# Altium project INV.OG5K.PW.V1.PrjPcb
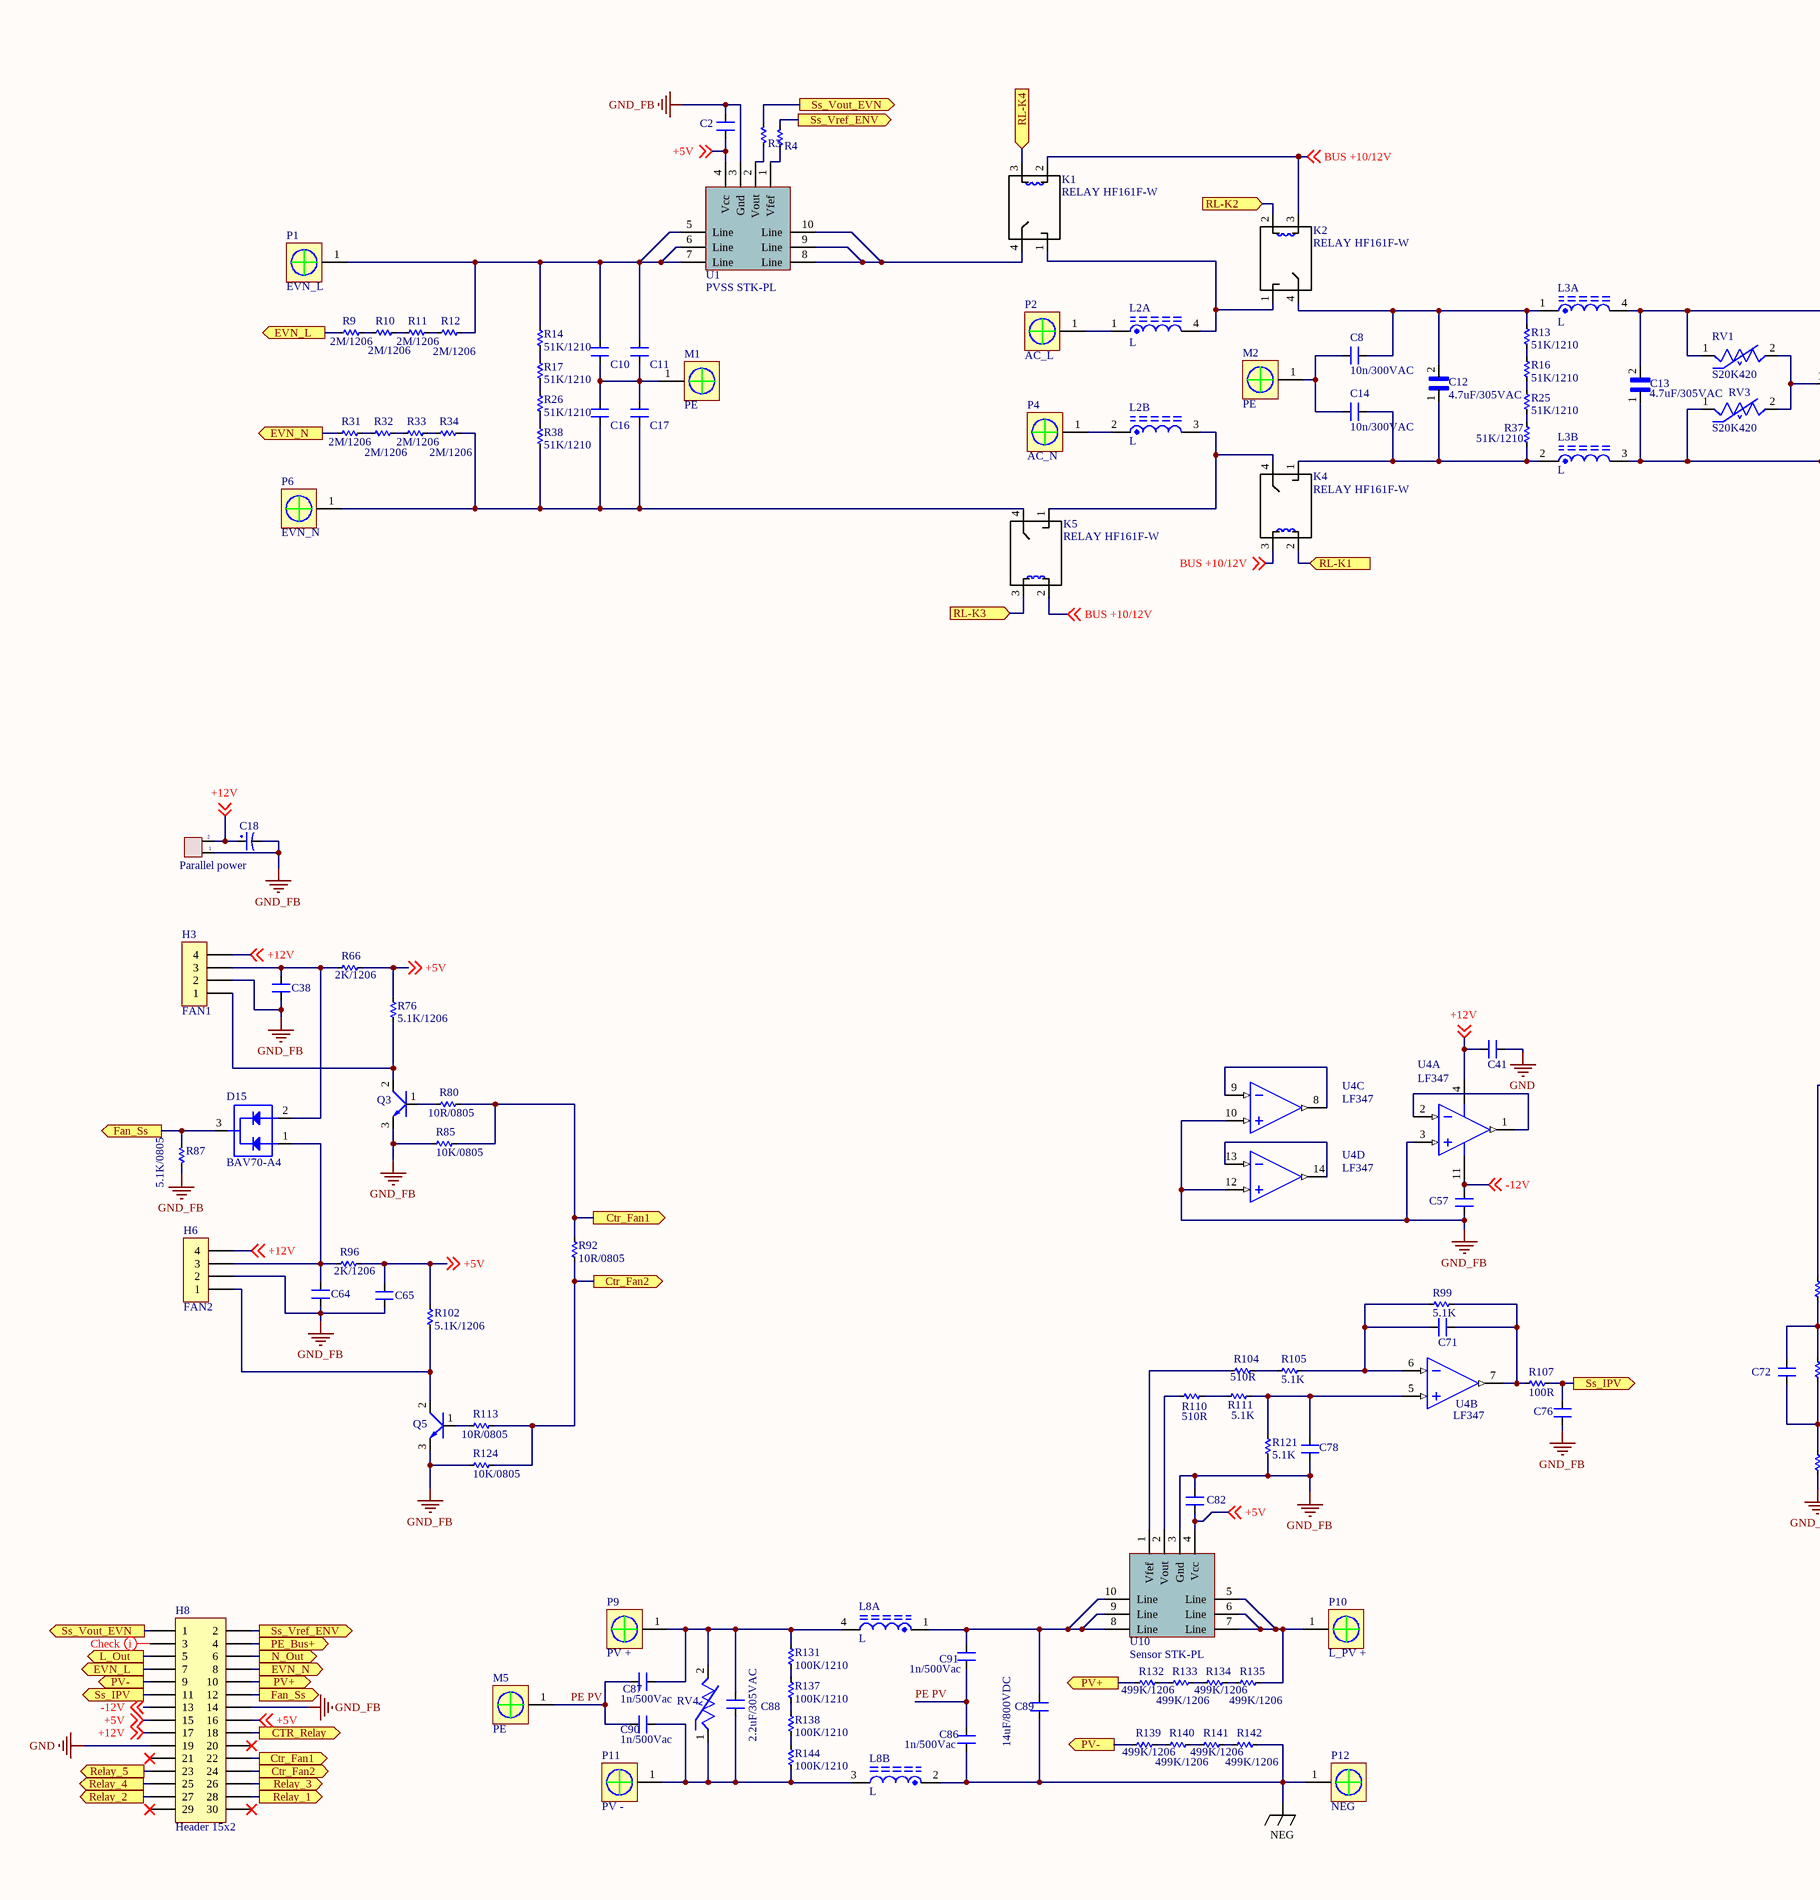
[diagram p0: INV.OG5K.PW.V1.SchDoc, left]
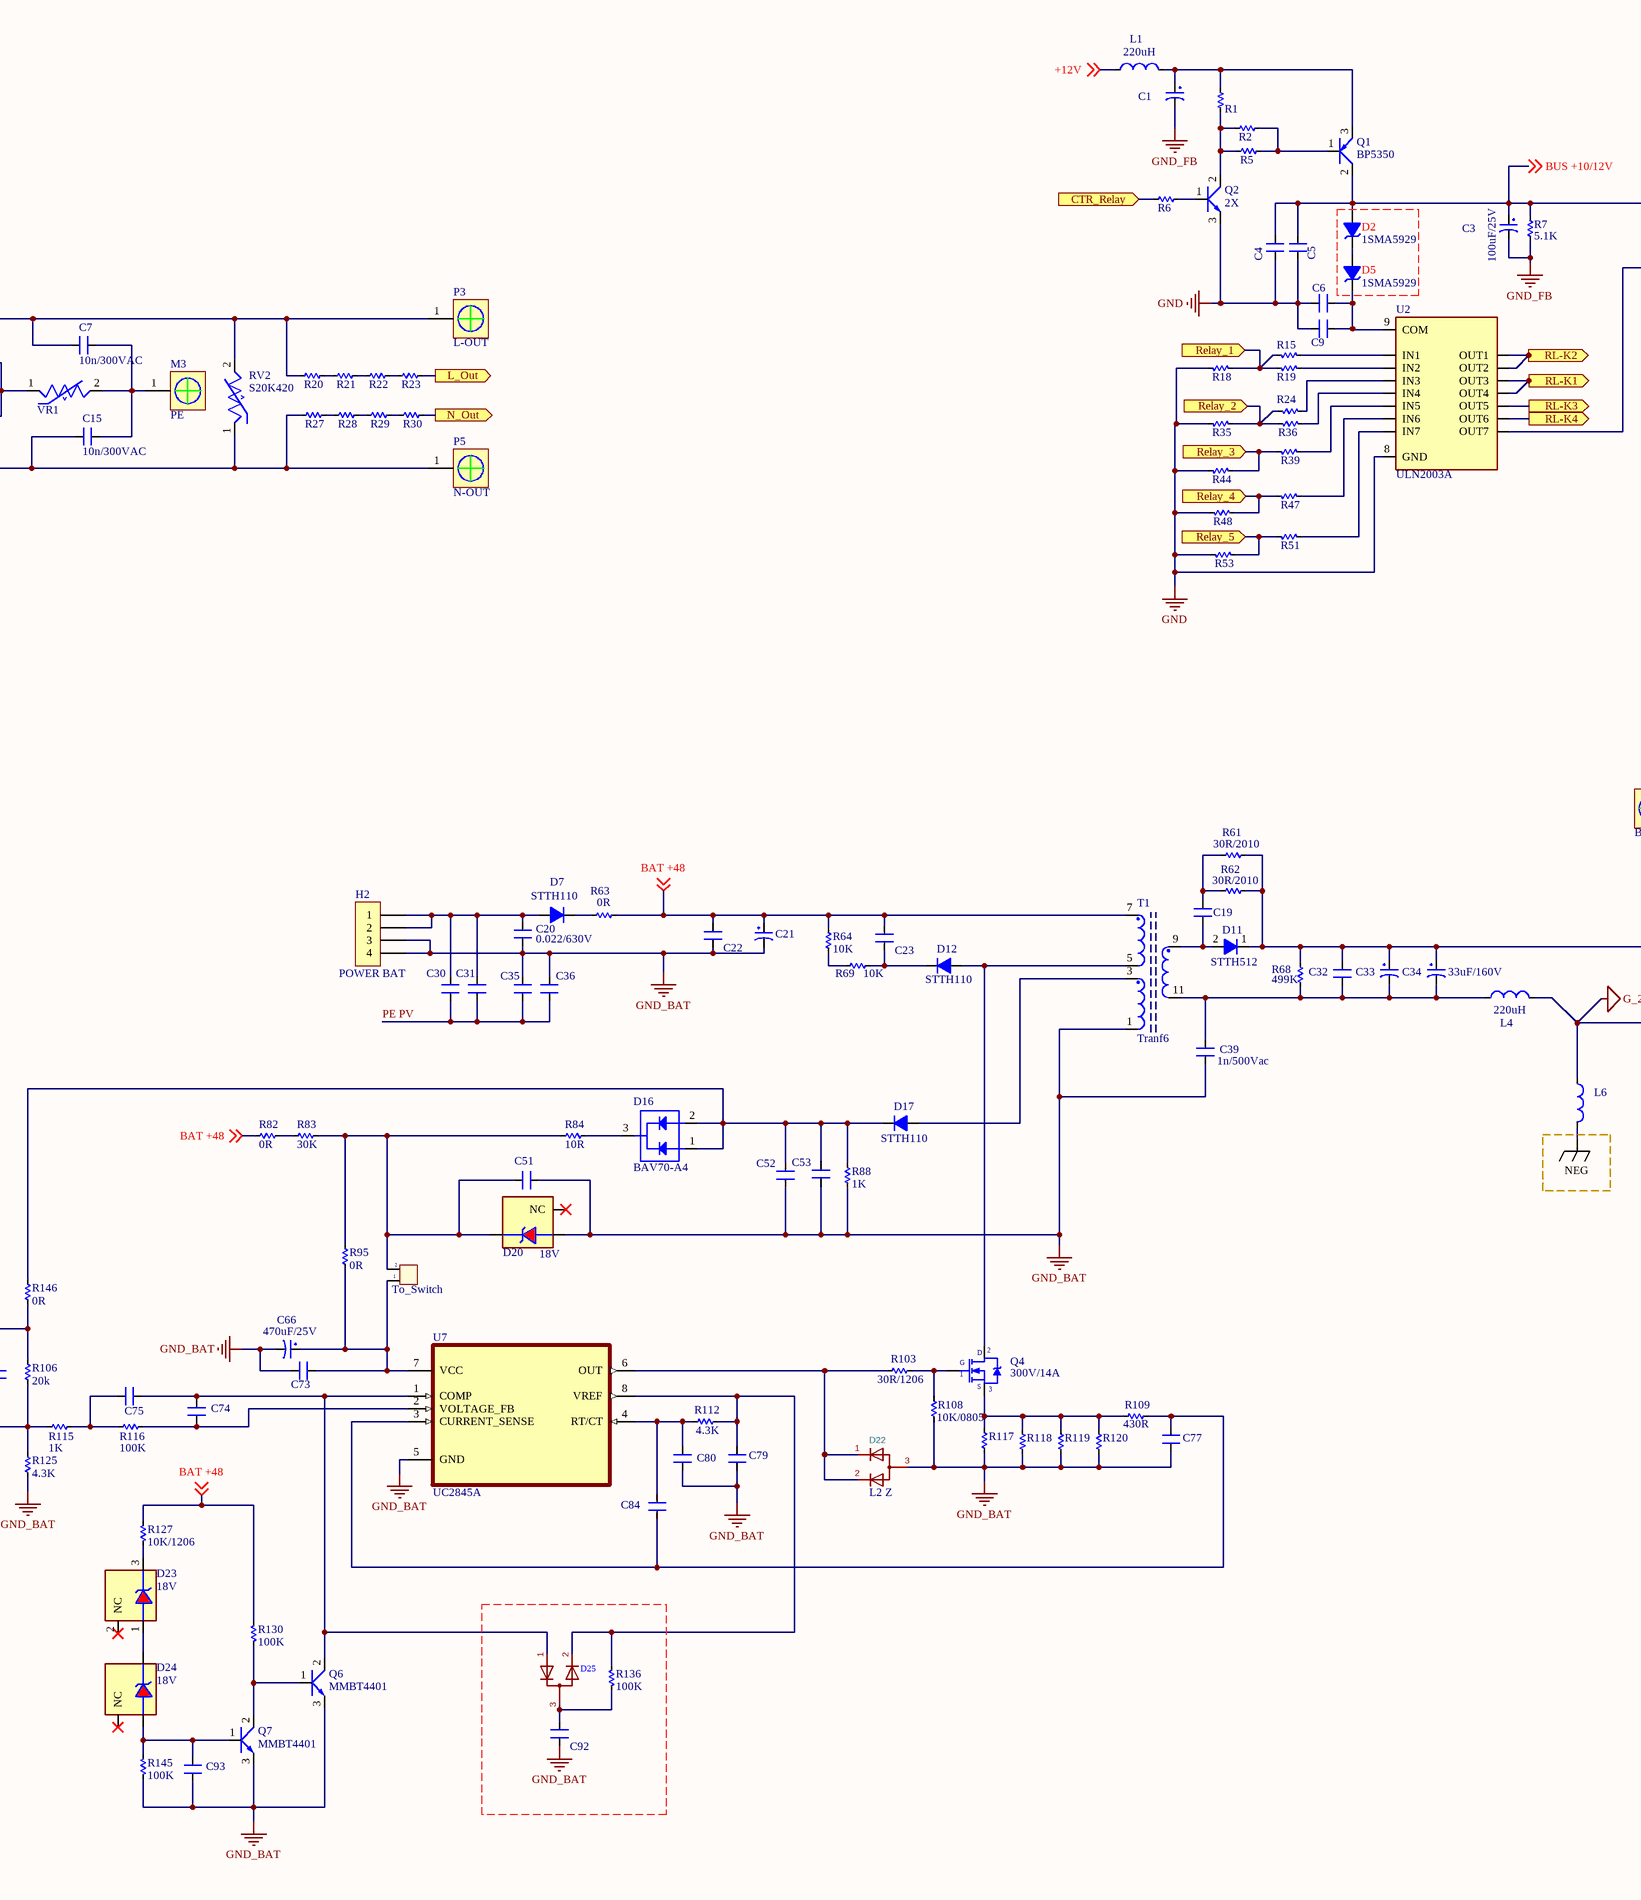
[diagram p1: INV.OG5K.PW.V1.SchDoc, middle]
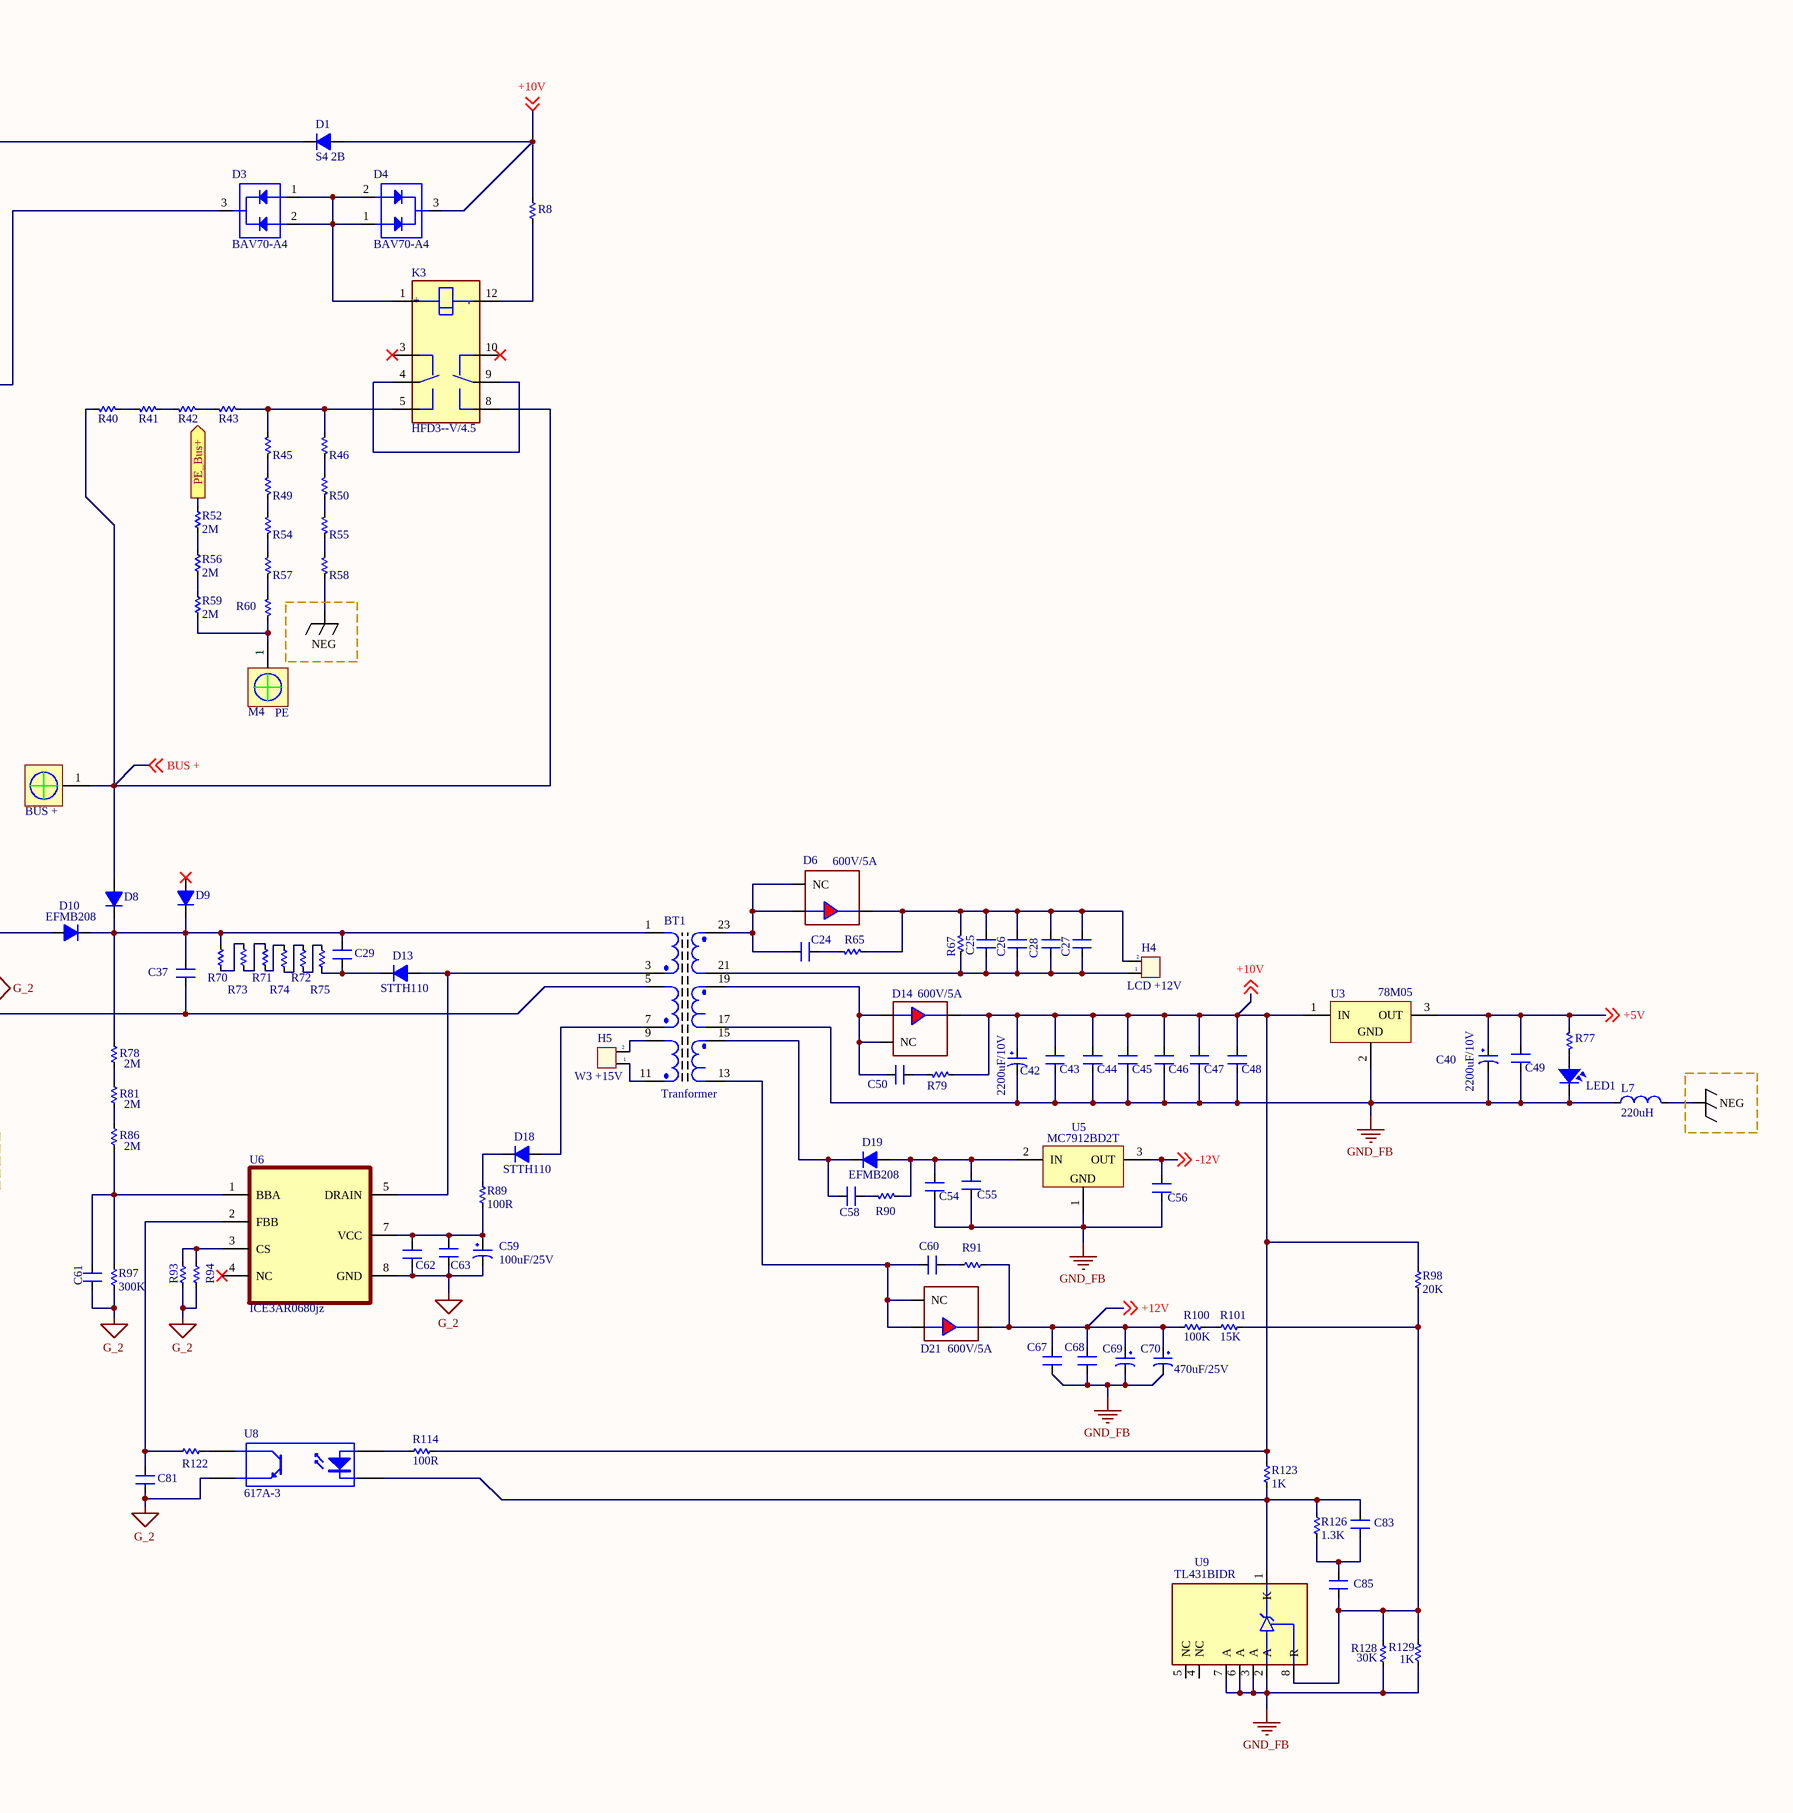
[diagram p2: INV.OG5K.PW.V1.SchDoc, right]
1 sheet, 324 parts. Net scope: flat (ports and power ports of the same name join across sheets).
Board file: INV.OG5K.PW.V1.PcbDoc

## Sheet INV.OG5K.PW.V1.SchDoc
size 1050 x 400 mm; SheetNumber: 1; SheetTotal: 1

### Parts
BT1  Tranformer  [Tranfomer 2-4]
C1  100uF/25V  [CAP-TH_BD6.3-P2.50-D0.6-FD]  (value not drawn)
C2  10n/300VAC  [CAP-SMD-0805 EX]  (value not drawn)
C3  100uF/25V  [CAP-TH_BD6.3-P2.50-D0.6-FD]
C4  (no value)  [CAP-SMD-0805]
C5  (no value)  [CAP-SMD-0805]
C6  (no value)  [CAP-SMD-0805]
C7  10n/300VAC  [Cap an toan CS103M]
C8  10n/300VAC  [Cap an toan CS103M]
C9  (no value)  [CAP-SMD-0805]
C10  10n/300VAC  [Cap an toan CS103M]  (value not drawn)
C11  10n/300VAC  [Cap an toan CS103M]  (value not drawn)
C12  4.7uF/305VAC  [CAP-TH_L31.5-W21.0-P27.50-D1.0]
C13  4.7uF/305VAC  [CAP-TH_L31.5-W21.0-P27.50-D1.0]
C14  10n/300VAC  [Cap an toan CS103M]
C15  10n/300VAC  [Cap an toan CS103M]
C16  10n/300VAC  [Cap an toan CS103M]  (value not drawn)
C17  10n/300VAC  [Cap an toan CS103M]  (value not drawn)
C18  470uF/25V  [CAP-TH_BD8.0-P3.50-D0.6-FD]  (value not drawn)
C19  (no value)  [CAP-SMD-1206]
C20  0.022/630V  [CAP-TH_L10.5-W5.0-P7.50-D1.2]
C21  27uF/100V  [CAP-TH_BD8.0-P3.50-D0.6-FD]  (value not drawn)
C22  (no value)  [CAP-SMD-1206]
C23  (no value)  [CAP-SMD-1206]
C24  (no value)  [CAP-SMD-1206]
C25  223J630V  [CAP-SMD-0805]  (value not drawn)
C26  223J630V  [CAP-SMD-0805]  (value not drawn)
C27  223J630V  [CAP-SMD-0805]  (value not drawn)
C28  223J630V  [CAP-SMD-0805]  (value not drawn)
C29  223J630V  [CAP-TH_L10.5-W5.0-P7.50-D1.2]  (value not drawn)
C30  (no value)  [CAP-TH_L10.5-W5.0-P7.50-D1.2]
C31  (no value)  [CAP-TH_L10.5-W5.0-P7.50-D1.2]
C32  (no value)  [CAP-SMD-1206]
C33  33uF/160V  [CAP-TH_BD13.0-P5.00-D0.6-FD]  (value not drawn)
C34  33uF/160V  [CAP-TH_BD13.0-P5.00-D0.6-FD]
C35  (no value)  [CAP-TH_L10.5-W5.0-P7.50-D1.2]
C36  (no value)  [CAP-TH_L10.5-W5.0-P7.50-D1.2]
C37  2uF/600VDC  [CAP DIP 31x12]  (value not drawn)
C38  (no value)  [CAP-SMD-0805]
C39  1n/500Vac  [CAP 1nF/500VAC, Y1]
C40  2200uF/10V  [CAP-TH_BD13.0-P5.00-D0.6-FD]
C41  (no value)  [CAP-SMD-0805]
C42  2200uF/10V  [CAP-TH_BD13.0-P5.00-D0.6-FD]
C43  (no value)  [CAP-SMD-0805]
C44  (no value)  [CAP-SMD-0805]
C45  (no value)  [CAP-SMD-0805]
C46  (no value)  [CAP-SMD-0805]
C47  (no value)  [CAP-SMD-0805]
C48  (no value)  [CAP-SMD-0805]
C49  (no value)  [CAP-SMD-0805]
C50  (no value)  [CAP-SMD-1206]
C51  (no value)  [CAP-SMD-0805]
C52  (no value)  [CAP-SMD-0805]
C53  (no value)  [CAP-SMD-0805]
C54  (no value)  [CAP-SMD-0805]
C55  (no value)  [CAP-SMD-0805]
C56  (no value)  [CAP-SMD-0805]
C57  (no value)  [CAP-SMD-0805]
C58  (no value)  [CAP-SMD-1206]
C59  100uF/25V  [CAP-TH_BD6.3-P2.50-D0.6-FD]
C60  (no value)  [CAP-SMD-1206]
C61  (no value)  [CAP-SMD-0805]
C62  223J630V  [CAP-SMD-0805]  (value not drawn)
C63  223J630V  [CAP-SMD-0805]  (value not drawn)
C64  (no value)  [CAP-SMD-0805]
C65  (no value)  [CAP-SMD-0805]
C66  470uF/25V  [CAP-TH_BD8.0-P3.50-D0.6-FD]
C67  (no value)  [CAP-SMD-0805]
C68  (no value)  [CAP-SMD-0805]
C69  470uF/25V  [CAP-TH_BD8.0-P3.50-D0.6-FD]  (value not drawn)
C70  470uF/25V  [CAP-TH_BD8.0-P3.50-D0.6-FD]
C71  (no value)  [CAP-SMD-0805]
C72  (no value)  [CAP-SMD-0805]
C73  (no value)  [CAP-SMD-0805]
C74  (no value)  [CAP-SMD-0805]
C75  (no value)  [CAP-SMD-0805]
C76  (no value)  [CAP-SMD-0805]
C77  (no value)  [CAP-SMD-0805]
C78  (no value)  [CAP-SMD-0805]
C79  (no value)  [CAP-SMD-0805]
C80  (no value)  [CAP-SMD-0805]
C81  (no value)  [CAP-SMD-0805]
C82  (no value)  [CAP-SMD-0805 EX]
C83  (no value)  [CAP-SMD-0805]
C84  (no value)  [CAP-SMD-0805]
C85  (no value)  [CAP-SMD-0805]
C86  1n/500Vac  [CAP 1nF/500VAC, Y1]
C87  1n/500Vac  [CAP 1nF/500VAC, Y1]
C88  2.2uF/305VAC  [CAP-TH_L26.5-W14.5-P22.50-D1.2]
C89  14uF/800VDC  [CAP DIP 42x18]
C90  1n/500Vac  [CAP 1nF/500VAC, Y1]
C91  1n/500Vac  [CAP 1nF/500VAC, Y1]
C92  (no value)  [CAP-SMD-0805]
C93  (no value)  [CAP-SMD-0805]
D1  S4 2B  [SMB]
D2  1SMA5929  [SMA]
D3  BAV70-A4  [SOT23-132]
D4  BAV70-A4  [SOT23-132]
D5  1SMA5929  [SMA]
D6  600V/5A  [TO252-132]
D7  STTH110  [SMA]
D8  EFMB208  [SMB]  (value not drawn)
D9  EFMB208  [SMB]  (value not drawn)
D10  EFMB208  [SMB]
D11  STTH512  [TO220 - DIP 2 Pin Heatsink]
D12  STTH110  [SMA]
D13  STTH110  [SMA]
D14  600V/5A  [TO252-132]
D15  BAV70-A4  [SOT23-132]
D16  BAV70-A4  [SOT23-132]
D17  STTH110  [SMA]
D18  STTH110  [SMB]
D19  EFMB208  [SMB]
D20  18V  [SOT23-132]
D21  600V/5A  [TO252-132]
D22  L2 Z  [SOT23-132]
D23  18V  [SOT23-132]
D24  18V  [SOT23-132]
D25  Dual-Diode_CA_1  [SOT23-132]  (value not drawn)
H1  Parallel power  [Header2]
H2  POWER BAT  [Header4]
H3  FAN1  [Header4]
H4  LCD +12V  [Header2]
H5  W3 +15V  [Header2]
H6  FAN2  [Header4]
H7  To_Switch  [Header2]
H8  Header 15x2  [Header 2x15 V2]
K1  RELAY HF161F-W  [RELAY HF161F-W]
K2  RELAY HF161F-W  [RELAY HF161F-W]
K3  HFD3--V/4.5  [RELAY 3/5-1]
K4  RELAY HF161F-W  [RELAY HF161F-W]
K5  RELAY HF161F-W  [RELAY HF161F-W]
L1  220uH  [IND-SMD_L10.2-W10.0_MS104R]
L2  L  [LAC2OG5K-V1]  (parts A,B of 2)
L3  L  [LAC1OG5K-V1]  (parts A,B of 2)
L4  220uH  [IND-SMD_L10.2-W10.0_MS104R]
L6  (no value)  [IND-SMD_L10.2-W10.0_MS104R]
L7  220uH  [IND-SMD_L10.2-W10.0_MS104R]
L8  L  [LPVOG5K-V1]  (parts A,B of 2)
LED1  LED  [LED-0805-Blue]  (value not drawn)
M1  PE  [COPER]
M2  PE  [COPER]
M3  PE  [COPER]
M4  PE  [COPER]
M5  PE  [COPER]
P1  EVN_L  [Copper Pipe 4 DIP]
P2  AC_L  [Copper Pipe 4 DIP]
P3  L-OUT  [Copper Pipe 4 DIP]
P4  AC_N  [Copper Pipe 4 DIP]
P5  N-OUT  [Copper Pipe 4 DIP]
P6  EVN_N  [Copper Pipe 4 DIP]
P8  BUS +  [Copper Pipe 4 DIP]
P9  PV +  [Copper Pipe 4 DIP]
P10  L_PV +  [Copper Pipe 4 DIP]
P11  PV -  [Copper Pipe 4 DIP]
P12  NEG  [Copper Pipe 4 DIP]
Q1  BP5350  [SOT223]
Q2  2X  [SOT23-123]
Q3  (no value)  [SOT23-123]
Q4  300V/14A  [TO263_123]
Q5  (no value)  [SOT23-123]
Q6  MMBT4401  [SOT23-123]
Q7  MMBT4401  [SOT23-123]
R1  10K  [RES-SMD-0805]  (value not drawn)
R2  2K  [RES-SMD-0805]  (value not drawn)
R3  1K/0603  [RES-SMD-0603 EX]  (value not drawn)
R4  1K/0603  [RES-SMD-0603 EX]  (value not drawn)
R5  2K  [RES-SMD-0805]  (value not drawn)
R6  20K  [RES-SMD-0805]  (value not drawn)
R7  5.1K  [RES-SMD-0805]
R8  51R  [RES-SMD-0805]  (value not drawn)
R9  2M/1206  [RES-SMD-1206]
R10  2M/1206  [RES-SMD-1206]
R11  2M/1206  [RES-SMD-1206]
R12  2M/1206  [RES-SMD-1206]
R13  51K/1210  [RES-SMD-1210 EX]
R14  51K/1210  [RES-SMD-1210 EX]
R15  10R  [RES-SMD-0805]  (value not drawn)
R16  51K/1210  [RES-SMD-1210 EX]
R17  51K/1210  [RES-SMD-1210 EX]
R18  5.1K  [RES-SMD-0805]  (value not drawn)
R19  10R  [RES-SMD-0805]  (value not drawn)
R20  2M/1206  [RES-SMD-1206]  (value not drawn)
R21  2M/1206  [RES-SMD-1206]  (value not drawn)
R22  2M/1206  [RES-SMD-1206]  (value not drawn)
R23  2M/1206  [RES-SMD-1206]  (value not drawn)
R24  10R  [RES-SMD-0805]  (value not drawn)
R25  51K/1210  [RES-SMD-1210 EX]
R26  51K/1210  [RES-SMD-1210 EX]
R27  2M/1206  [RES-SMD-1206]  (value not drawn)
R28  2M/1206  [RES-SMD-1206]  (value not drawn)
R29  2M/1206  [RES-SMD-1206]  (value not drawn)
R30  2M/1206  [RES-SMD-1206]  (value not drawn)
R31  2M/1206  [RES-SMD-1206]
R32  2M/1206  [RES-SMD-1206]
R33  2M/1206  [RES-SMD-1206]
R34  2M/1206  [RES-SMD-1206]
R35  5.1K  [RES-SMD-0805]  (value not drawn)
R36  10R  [RES-SMD-0805]  (value not drawn)
R37  51K/1210  [RES-SMD-1210 EX]
R38  51K/1210  [RES-SMD-1210 EX]
R39  10R  [RES-SMD-0805]  (value not drawn)
R40  499K  [RES-SMD-1206]  (value not drawn)
R41  499K  [RES-SMD-1206]  (value not drawn)
R42  499K  [RES-SMD-1206]  (value not drawn)
R43  499K  [RES-SMD-1206]  (value not drawn)
R44  5.1K  [RES-SMD-0805]  (value not drawn)
R45  200K  [RES-SMD-1206]  (value not drawn)
R46  499K  [RES-SMD-1206]  (value not drawn)
R47  10R  [RES-SMD-0805]  (value not drawn)
R48  5.1K  [RES-SMD-0805]  (value not drawn)
R49  200K  [RES-SMD-1206]  (value not drawn)
R50  499K  [RES-SMD-1206]  (value not drawn)
R51  10R  [RES-SMD-0805]  (value not drawn)
R52  2M  [RES-SMD-1206]
R53  5.1K  [RES-SMD-0805]  (value not drawn)
R54  200K  [RES-SMD-1206]  (value not drawn)
R55  499K  [RES-SMD-1206]  (value not drawn)
R56  2M  [RES-SMD-1206]
R57  200K  [RES-SMD-1206]  (value not drawn)
R58  499K  [RES-SMD-1206]  (value not drawn)
R59  2M  [RES-SMD-1206]
R60  200K  [RES-SMD-1206]  (value not drawn)
R61  30R/2010  [RES-SMD-1210]
R62  30R/2010  [RES-SMD-1210]
R63  0R  [RES-SMD-1206]
R64  10K  [RES-SMD-0805]
R65  10K/2010  [RES-SMD-1206]  (value not drawn)
R66  2K/1206  [RES-SMD-1206]
R67  10K/2010  [RES-SMD-0805]  (value not drawn)
R68  499K  [RES-SMD-1206]
R69  10K  [RES-SMD-0805]
R70  10K/2010  [RES-SMD-1210]  (value not drawn)
R71  10K/2010  [RES-SMD-1210]  (value not drawn)
R72  10K/2010  [RES-SMD-1210]  (value not drawn)
R73  10K/2010  [RES-SMD-1210]  (value not drawn)
R74  10K/2010  [RES-SMD-1210]  (value not drawn)
R75  10K/2010  [RES-SMD-1210]  (value not drawn)
R76  5.1K/1206  [RES-SMD-1206]
R77  5.1K  [RES-SMD-0805]  (value not drawn)
R78  2M  [RES-SMD-1206]
R79  10K/2010  [RES-SMD-1206]  (value not drawn)
R80  10R/0805  [RES-SMD-0805]
R81  2M  [RES-SMD-1206]
R82  0R  [RES-SMD-0805]
R83  30K  [RES-SMD-0805]
R84  10R  [RES-SMD-1206]
R85  10K/0805  [RES-SMD-0805]
R86  2M  [RES-SMD-1206]
R87  5.1K/0805  [RES-SMD-0805 EX]
R88  1K  [RES-SMD-1210]
R89  100R  [RES-SMD-0805]
R90  150R/1206  [RES-SMD-1206]  (value not drawn)
R91  150R/1206  [RES-SMD-1206]  (value not drawn)
R92  10R/0805  [RES-SMD-0805]
R93  0.33R/2010  [RES-SMD-1210]  (value not drawn)
R94  0.33R/2010  [RES-SMD-1210]  (value not drawn)
R95  0R  [RES-SMD-1206]
R96  2K/1206  [RES-SMD-1206]
R97  300K  [RES-SMD-0805]
R98  20K  [RES-SMD-0805]
R99  5.1K  [RES-SMD-0805]
R100  100K  [RES-SMD-0805]
R101  15K  [RES-SMD-0805]
R102  5.1K/1206  [RES-SMD-1206]
R103  30R/1206  [RES-SMD-1206]
R104  510R  [RES-SMD-0805]
R105  5.1K  [RES-SMD-0805]
R106  20k  [RES-SMD-0805]
R107  100R  [RES-SMD-0805]
R108  10K/0805  [RES-SMD-0805]
R109  430R  [RES-SMD-0805]
R110  510R  [RES-SMD-0805]
R111  5.1K  [RES-SMD-0805]
R112  4.3K  [RES-SMD-0805]
R113  10R/0805  [RES-SMD-0805]
R114  100R  [RES-SMD-0805]
R115  1K  [RES-SMD-0805]
R116  100K  [RES-SMD-0805]
R117  0.33R/2010  [RES-SMD-1210 EX]  (value not drawn)
R118  0.33R/2010  [RES-SMD-1210 EX]  (value not drawn)
R119  0.33R/2010  [RES-SMD-1210 EX]  (value not drawn)
R120  0.33R/2010  [RES-SMD-1210 EX]  (value not drawn)
R121  5.1K  [RES-SMD-0805]
R122  22R  [RES-SMD-0805]  (value not drawn)
R123  1K  [RES-SMD-0805]
R124  10K/0805  [RES-SMD-0805]
R125  4.3K  [RES-SMD-0805]
R126  1.3K  [RES-SMD-0805]
R127  10K/1206  [RES-SMD-1206]
R128  30K  [RES-SMD-0805]
R129  1K  [RES-SMD-0805]
R130  100K  [RES-SMD-0805]
R131  100K/1210  [RES-SMD-1210]
R132  499K/1206  [RES-SMD-1206]
R133  499K/1206  [RES-SMD-1206]
R134  499K/1206  [RES-SMD-1206]
R135  499K/1206  [RES-SMD-1206]
R136  100K  [RES-SMD-0805]
R137  100K/1210  [RES-SMD-1210]
R138  100K/1210  [RES-SMD-1210]
R139  499K/1206  [RES-SMD-1206]
R140  499K/1206  [RES-SMD-1206]
R141  499K/1206  [RES-SMD-1206]
R142  499K/1206  [RES-SMD-1206]
R144  100K/1210  [RES-SMD-1210]
R145  100K  [RES-SMD-0805]
R146  0R  [RES-SMD-0805]
RV1  S20K420  [VAR_B72220S0301K101]
RV2  S20K420  [VAR_B72220S0301K101]
RV3  S20K420  [VAR_B72220S0301K101]
RV4  S20K420  [VAR_B72220S0301K101]  (value not drawn)
T1  Tranf6  [tranf6]
U1  PVSS STK-PL  [SENSOR-STK-PL]
U2  ULN2003A  [SO16]
U3  78M05  [TO252]
U4  LF347  [SO14]  (parts A,B,C,D of 4)
U5  MC7912BD2T  [TO263_123]
U6  ICE3AR0680jz  [PG-DIP-7_L9.5-W6.4-P2.54-LS7.6-BL-PE6]
U7  UC2845A  [SOIC127P600X175-8N]
U8  617A-3  [OPTO TRANSISTOR_SMD-4]
U9  TL431BIDR  [SOIC127P600X175-8N]
U10  Sensor STK-PL  [SENSOR-STK-PL]
VR1  EPCOS  [Cap EPCOS 21]  (value not drawn)

### Ports
Ctr_Fan1 (out, see INV.OG5K.PW.V1[1C]), Ctr_Fan1 (out, see INV.OG5K.PW.V1[1D]), Ctr_Fan2 (out, see INV.OG5K.PW.V1[1C]), Ctr_Fan2 (out, see INV.OG5K.PW.V1[1D]), CTR_Relay (in, see INV.OG5K.PW.V1[1D]), CTR_Relay (out, see INV.OG5K.PW.V1[4A]), EVN_L (out, see INV.OG5K.PW.V1[1A]), EVN_L (out, see INV.OG5K.PW.V1[1D]), EVN_N (out, see INV.OG5K.PW.V1[1A]), EVN_N (out, see INV.OG5K.PW.V1[1D]), Fan_Ss (out, see INV.OG5K.PW.V1[1C]), Fan_Ss (out, see INV.OG5K.PW.V1[1D]), L_Out (out, see INV.OG5K.PW.V1[1D]), L_Out (out, see INV.OG5K.PW.V1[3A]), N_Out (out, see INV.OG5K.PW.V1[1D]), N_Out (out, see INV.OG5K.PW.V1[3A]), PE_Bus+ (out, see INV.OG5K.PW.V1[1D]), PE_Bus+ (out, see INV.OG5K.PW.V1[5B]), PV+ (out, see INV.OG5K.PW.V1[1D]), PV+ (out, see INV.OG5K.PW.V1[2D]), PV- (out, see INV.OG5K.PW.V1[1D]), PV- (out, see INV.OG5K.PW.V1[2D]), Relay_1 (in, see INV.OG5K.PW.V1[1D]), Relay_1 (out, see INV.OG5K.PW.V1[4A]), Relay_2 (in, see INV.OG5K.PW.V1[1D]), Relay_2 (out, see INV.OG5K.PW.V1[4A]), Relay_3 (in, see INV.OG5K.PW.V1[1D]), Relay_3 (out, see INV.OG5K.PW.V1[4A]), Relay_4 (in, see INV.OG5K.PW.V1[1D]), Relay_4 (out, see INV.OG5K.PW.V1[4B]), Relay_5 (in, see INV.OG5K.PW.V1[1D]), Relay_5 (out, see INV.OG5K.PW.V1[4B]), RL-K1 (in, see INV.OG5K.PW.V1[4A]), RL-K1 (out, see INV.OG5K.PW.V1[2B]), RL-K2 (in, see INV.OG5K.PW.V1[4A]), RL-K2 (out, see INV.OG5K.PW.V1[2A]), RL-K3 (in, see INV.OG5K.PW.V1[4A]), RL-K3 (out, see INV.OG5K.PW.V1[2B]), RL-K4 (in, see INV.OG5K.PW.V1[4A]), RL-K4 (out, see INV.OG5K.PW.V1[2A]), Ss_IPV (out, see INV.OG5K.PW.V1[1D]), Ss_IPV (out, see INV.OG5K.PW.V1[2C]), Ss_Vout_EVN (out, see INV.OG5K.PW.V1[1D]), Ss_Vout_EVN (out, see INV.OG5K.PW.V1[2A]), Ss_Vref_ENV (out, see INV.OG5K.PW.V1[1D]), Ss_Vref_ENV (out, see INV.OG5K.PW.V1[2A])

### Nets
G_2: BT1.5 C37.1 C59.2 C61.1 C62.2 C63.2 C81.1 L4.2 L6.2 R93.2 R94.2 R97.1 U6.8(GND) U8.3
GND: C4.1 C5.1 C6.1 C9.1 C41.2 H8.19 Q2.3(E) R18.2 R35.2 R44.2 R48.2 R53.2 U2.8(GND)
GND_BAT: C20.1 C21.2 C22.1 C35.2 C36.2 C39.2 C51.1 C52.1 C53.1 C66.2 C73.1 C77.1 C79.1 C80.1 C92.1 C93.2 D20.1(A) D22.3(A) H2.3 H2.4 Q6.3(E) Q7.3(E) R88.2 R108.2 R117.2 R118.2 R119.2 R120.2 R125.2 R145.2 T1.1 U7.5(GND)
GND_FB: BT1.17 C1.2 C2.2 C3.2 C18.2 C38.1 C40.2 C42.2 C43.2 C44.2 C45.2 C46.2 C47.2 C48.2 C49.2 C54.1 C55.1 C56.1 C57.2 C64.1 C65.1 C67.1 C68.1 C69.2 C70.2 C76.2 C78.2 C82.2 H1.1 H3.2 H6.2 H8.14 L7.1 LED1.2 Q3.3(E) Q5.3(E) R7.1 R85.2 R87.1 R121.2 R124.2 R128.1 R129.1 U1.3(Gnd) U3.2(GND) U4.3(1_IN+) U4.10(3_IN+) U4.12(4_IN+) U5.1(GND) U9.2(A) U9.3(A) U9.6(A) U9.7(A) U10.3(Gnd)
NEG: C86.1 C89.1 L6.1 L7.2 L8.2 P12.1 R58.2 R142.1
+5V: C2.1 C40.1 C49.1 C65.2 C82.1 H8.15 H8.16 R66.2 R76.2 R77.2 R96.2 R102.2 U1.4(Vcc) U3.3(OUT) U10.4(Vcc) ; off-sheet +5V
+10V: C42.1 C43.1 C44.1 C45.1 C46.1 C47.1 C48.1 D1.1(A) D4.3(K) D14.3(K) R8.1 R79.1 R98.1 R114.1 R123.1 U3.1(IN) ; off-sheet +10V
+12V: C18.1 C41.1 C67.2 C68.2 C69.1 C70.1 D21.3(K) H1.2 H3.4 H6.4 H8.17 L1.1 R91.1 R100.2 U4.4(VCC) ; off-sheet +12V
-12V: C56.2 C57.1 H8.13 U4.11(VEE) U5.3(OUT) ; off-sheet -12V
BAT +48: C21.1 C22.2 C23.1 R63.2 R64.1 R82.1 R127.2 R130.1 T1.7 ; off-sheet BAT +48
BUS +: D8.1(A) K3.8 P8.1 R40.1 ; off-sheet BUS +
BUS +10/12V: C3.1 C4.2 C5.2 D1.2(K) D2.2(A) K1.2 K2.3 K4.3 K5.2 Q1.2(C) R7.2 ; off-sheet BUS +10/12V
PE PV: C30.1 C31.1 C35.1 C36.1 C86.2 C87.1 C90.1 C91.2 M5.1
NetBT1_1: BT1.1 C29.2 C37.2 D8.2(K) D9.2(K) D10.2(K) R70.2 R78.2
NetBT1_3: BT1.3 D13.1(A) U6.5(DRAIN)
NetBT1_7: BT1.7 D18.1(A)
NetBT1_9: BT1.9 H5.2
NetBT1_11: BT1.11 H5.1
NetBT1_13: BT1.13 C60.2 D21.1(A) D21.2(NC)
NetBT1_15: BT1.15 C58.2 D19.2(K)
NetBT1_19: BT1.19 C50.2 D14.1(A) D14.2(NC)
NetBT1_21: BT1.21 C25.2 C26.2 C27.2 C28.2 H4.1 R67.2
NetBT1_23: BT1.23 C24.1 D6.1(A) D6.2(NC)
NetC1_1: C1.1 L1.2 Q1.3(E) R1.2
NetC6_2: C6.2 C9.2 D5.1(K) U2.9(COM)
NetC7_1: C7.1 C13.2 L3.4 P3.1 R20.1 RV1.1 RV2.2
NetC7_2: C7.2 C15.2 M3.1 VR1.2
NetC8_1: C8.1 C12.2 K2.4 L3.1 R13.1
NetC8_2: C8.2 C14.1 M2.1
NetC10_1: C10.1 C11.1 P1.1 R12.1 R14.1 U1.5(Line) U1.6(Line) U1.7(Line)
NetC10_2: C10.2 C11.2 C16.1 C17.1 M1.1
NetC12_1: C12.1 C14.2 K4.1 L3.2 R37.2
NetC13_1: C13.1 C15.1 L3.3 P5.1 R27.1 RV2.1 RV3.1
NetC16_2: C16.2 C17.2 K5.4 P6.1 R34.1 R38.2
NetC19_1: C19.1 D11.2(A) T1.9
NetC19_2: C19.2 R61.1 R62.1
NetC20_2: C20.2 C30.2 C31.2 D7.1(A) H2.1 H2.2
NetC23_2: C23.2 D12.2(K) R69.1
NetC24_2: C24.2 R65.1
NetC25_1: C25.1 C26.1 C27.1 C28.1 D6.3(K) H4.2 R65.2 R67.1
NetC29_1: C29.1 D13.2(K) R75.1
NetC32_1: C32.1 C33.1 C34.1 D10.1(A) D11.1(K) R61.2 R62.2 R68.1
NetC32_2: C32.2 C33.2 C34.2 C39.1 L4.1 R68.2 T1.11
NetC38_2: C38.2 D15.2(A2) H3.3 R66.1
NetC50_1: C50.1 R79.2
NetC51_2: C51.2 D20.3(K) H7.2 R83.2 R84.1 R95.1
NetC52_2: C52.2 C53.2 D16.1(A1) D16.2(A2) D17.2(K) R88.1 R146.1
NetC54_2: C54.2 C55.2 D19.1(A) R90.1 U5.2(IN)
NetC58_1: C58.1 R90.2
NetC59_1: C59.1 C62.1 C63.1 R89.2 U6.7(VCC)
NetC60_1: C60.1 R91.2
NetC61_2: C61.2 R86.1 R97.2 U6.1(BBA)
NetC64_2: C64.2 D15.1(A1) H6.3 R96.1
NetC66_1: C66.1 C73.2 H7.1 R95.2 U7.7(VCC)
NetC71_1: C71.1 R99.1 R107.2 U4.7(2_OUT)
NetC71_2: C71.2 R99.2 R105.1 U4.6(2_IN-)
NetC72_1: C72.1 R106.2 R115.2 R125.1
NetC72_2: C72.2 R106.1 R146.2
NetC74_1: C74.1 C75.2 D25.1(C) Q6.2(C) U7.1(COMP)
NetC74_2: C74.2 R116.1 U7.2(VOLTAGE_FB)
NetC75_1: C75.1 R115.1 R116.2
NetC76_1: C76.1 H8.11 R107.1 ; port Ss_IPV
NetC77_2: C77.2 C84.1 R109.2 U7.3(CURRENT_SENSE)
NetC78_1: C78.1 R111.2 R121.1 U4.5(2_IN+)
NetC79_2: C79.2 D25.2(C) R112.2 R136.1 U7.8(VREF)
NetC80_2: C80.2 C84.2 R112.1 U7.4(RT/CT)
NetC81_2: C81.2 R122.1 U6.2(FBB)
NetC83_1: C83.1 R123.2 R126.1 U8.2 U9.1(K)
NetC83_2: C83.2 C85.1 R126.2
NetC85_2: C85.2 R98.2 R101.1 R128.2 R129.2 U9.8(R)
NetC87_2: C87.2 C88.2 L8.4 P9.1 R131.1 RV4.2
NetC88_1: C88.1 C90.2 L8.3 P11.1 R144.1 RV4.1
NetC89_2: C89.2 C91.1 L8.1 U10.8(Line) U10.9(Line) U10.10(Line)
NetC92_2: C92.2 D25.3(A) R136.2
NetC93_1: C93.1 D24.1(A) Q7.1(B) R145.1
NetD2_1: D2.1(K) D5.2(A)
NetD3_1: D3.1(A1) D3.2(A2) D4.1(A1) D4.2(A2) K3.1
NetD3_3: D3.3(K) U2.10(OUT7)
NetD7_2: D7.2(K) R63.1
NetD12_1: D12.1(A) Q4.2(D) T1.5
NetD15_3: D15.3(K) H8.12 R87.2 ; port Fan_Ss
NetD16_3: D16.3(K) R84.2
NetD17_1: D17.1(A) T1.3
NetD18_2: D18.2(K) R89.1
NetD22_1: D22.1(C) D22.2(C) R103.2 U7.6(OUT)
NetD23_1: D23.1(A) D24.3(K)
NetD23_3: D23.3(K) R127.1
NetH3_1: H3.1 Q3.2(C) R76.1
NetH6_1: H6.1 Q5.2(C) R102.1
NetH8_1: H8.1 R3.1 ; port Ss_Vout_EVN
NetH8_2: H8.2 R4.1 ; port Ss_Vref_ENV
NetH8_4: H8.4 R52.2 ; port PE_Bus+
NetH8_5: H8.5 R23.2 ; port L_Out
NetH8_6: H8.6 R30.2 ; port N_Out
NetH8_7: H8.7 R9.2 ; port EVN_L
NetH8_8: H8.8 R31.2 ; port EVN_N
NetH8_9: H8.9 R139.1 ; port PV-
NetH8_10: H8.10 R132.1 ; port PV+
NetH8_18: H8.18 R6.1 ; port CTR_Relay
NetH8_22: H8.22 R80.1 R85.1 R92.1 ; port Ctr_Fan1
NetH8_23: H8.23 R51.2 R53.1 ; port Relay_5
NetH8_24: H8.24 R92.2 R113.1 R124.1 ; port Ctr_Fan2
NetH8_25: H8.25 R47.2 R48.1 ; port Relay_4
NetH8_26: H8.26 R39.2 R44.1 ; port Relay_3
NetH8_27: H8.27 R24.2 R35.1 R36.2 ; port Relay_2
NetH8_28: H8.28 R15.2 R18.1 R19.2 ; port Relay_1
NetK1_1: K1.1 K2.1 L2.4
NetK1_3: K1.3 U2.11(OUT6) ; port RL-K4
NetK1_4: K1.4 U1.8(Line) U1.9(Line) U1.10(Line)
NetK2_2: K2.2 U2.15(OUT2) U2.16(OUT1) ; port RL-K2
NetK3_4: K3.4 K3.9
NetK3_5: K3.5 R43.2 R45.1 R46.1
NetK3_12: K3.12 R8.2
NetK4_2: K4.2 U2.13(OUT4) U2.14(OUT3) ; port RL-K1
NetK4_4: K4.4 K5.1 L2.3
NetK5_3: K5.3 U2.12(OUT5) ; port RL-K3
NetL2_1: L2.1 P2.1
NetL2_2: L2.2 P4.1
NetLED1_1: LED1.1 R77.1
NetM4_1: M4.1 R59.1 R60.2
NetP10_1: P10.1 R135.1 U10.5(Line) U10.6(Line) U10.7(Line)
NetQ1_1: Q1.1(B) R2.1 R5.2
NetQ2_1: Q2.1(B) R6.2
NetQ2_2: Q2.2(C) R1.1 R2.2 R5.1
NetQ3_1: Q3.1(B) R80.2
NetQ4_1: Q4.1(G) R103.1 R108.1
NetQ4_3: Q4.3(S) R109.1 R117.1 R118.1 R119.1 R120.1
NetQ5_1: Q5.1(B) R113.2
NetQ6_1: Q6.1(B) Q7.2(C) R130.2
NetR3_2: R3.2 U1.2(Vout)
NetR4_2: R4.2 U1.1(Vfef)
NetR9_1: R9.1 R10.2
NetR10_1: R10.1 R11.2
NetR11_1: R11.1 R12.2
NetR13_2: R13.2 R16.1
NetR14_2: R14.2 R17.1
NetR15_1: R15.1 U2.1(IN1)
NetR16_2: R16.2 R25.1
NetR17_2: R17.2 R26.1
NetR19_1: R19.1 U2.2(IN2)
NetR20_2: R20.2 R21.1
NetR21_2: R21.2 R22.1
NetR22_2: R22.2 R23.1
NetR24_1: R24.1 U2.3(IN3)
NetR25_2: R25.2 R37.1
NetR26_2: R26.2 R38.1
NetR27_2: R27.2 R28.1
NetR28_2: R28.2 R29.1
NetR29_2: R29.2 R30.1
NetR31_1: R31.1 R32.2
NetR32_1: R32.1 R33.2
NetR33_1: R33.1 R34.2
NetR36_1: R36.1 U2.4(IN4)
NetR39_1: R39.1 U2.5(IN5)
NetR40_2: R40.2 R41.1
NetR41_2: R41.2 R42.1
NetR42_2: R42.2 R43.1
NetR45_2: R45.2 R49.1
NetR46_2: R46.2 R50.1
NetR47_1: R47.1 U2.6(IN6)
NetR49_2: R49.2 R54.1
NetR50_2: R50.2 R55.1
NetR51_1: R51.1 U2.7(IN7)
NetR52_1: R52.1 R56.2
NetR54_2: R54.2 R57.1
NetR55_2: R55.2 R58.1
NetR56_1: R56.1 R59.2
NetR57_2: R57.2 R60.1
NetR64_2: R64.2 R69.2
NetR70_1: R70.1 R73.2
NetR71_1: R71.1 R74.2
NetR71_2: R71.2 R73.1
NetR72_1: R72.1 R75.2
NetR72_2: R72.2 R74.1
NetR78_1: R78.1 R81.2
NetR81_1: R81.1 R86.2
NetR82_2: R82.2 R83.1
NetR93_1: R93.1 R94.1 U6.3(CS)
NetR100_1: R100.1 R101.2
NetR104_1: R104.1 U10.1(Vfef)
NetR104_2: R104.2 R105.2
NetR110_1: R110.1 U10.2(Vout)
NetR110_2: R110.2 R111.1
NetR114_2: R114.2 U8.1
NetR122_2: R122.2 U8.4
NetR131_2: R131.2 R137.2
NetR132_2: R132.2 R133.2
NetR133_1: R133.1 R134.1
NetR134_2: R134.2 R135.2
NetR137_1: R137.1 R138.1
NetR138_2: R138.2 R144.2
NetR139_2: R139.2 R140.2
NetR140_1: R140.1 R141.1
NetR141_2: R141.2 R142.2
NetRV1_2: RV1.2 RV3.2 VR1.1
NetU4_1: U4.1(1_OUT) U4.2(1_IN-)
NetU4_8: U4.8(3_OUT) U4.9(3_IN-)
NetU4_13: U4.13(4_IN-) U4.14(4_OUT)

Not connected (* = marked no-connect by the designer): D9 1(A)*; D20 2(NC)*; D23 2(NC)*; D24 2(NC)*; H8 3 20* 21* 29* 30*; K3 3* 10*; U6 4(NC)*; U9 4(NC) 5(NC)

### Layout directives
mark named Check: NetH8_3

### Notes on the sheet
- (in symbol HFD3--V/4.5) +; -

### Library data of the parts
BT1 = Tranfomer 2-4: Bien ap xung DVD; Designed by: VanDungEvn; Value: BAX
C1 C3 C18 C33 C34 C40 C42 C69 C70 = Cap - 10x18 - N: Chung_Loai: Cắm; Don_Vi: Con; So_Chan: 2; Ten_Linh_Kien: Tụ Hóa 220uF 10V 6x11MM; Ma_Hang: MH004510; Kieu_Chan: *
C2 C7 C8 C10 C11 C14-C17 = CAP-SMD: High Voltage Ceramic Capacitors CS103M; Value: 33pF
C4-C6 C9 C19 C22-C32 C35-C39 C41 C43-C58 C60-C65 C67 C68 C71-C93 = CAP-SMD: Value: 33pF
C12 C13 = ECWFG2J475KA: Polypropylene Film Capacitor, 305V ac, ±20%, 4.7μF; MF: Panasonic; Value: *; Price: None; Package: MOLDED-2 Panasonic; MP: ECWFG2J475KA; Availability: In Stock; Check_prices: https://www.snapeda.com/parts/ECWFG2J475KA/Panasonic/view-part/?ref=eda; SnapEDA_Link: https://www.snapeda.com/parts/ECWFG2J475KA/Panasonic/view-part/?ref=snap
C20 = CAP-SMD: WIMA MKS 4 Metallized Polyester (PET) Capacitors; Value: 33pF
C21 C59 C66 = Cap - 10x18 - N: Cắm 100uF 25V; Don_Vi: Con; So_Chan: 2; Ten_Linh_Kien: Tụ Hóa 220uF 10V 6x11MM; Ma_Hang: MH004510; Chung_Loai: Cắm; Kieu_Chan: *
D1 = DIODE: Value: 1N4007
D2 D5 = DIODE ZENNER: Diode Zenner 15V; Value: DFLZ16Q
D3 D4 D15 D16 = Diode Double: MP: STTH2003CG-TR; Package: None; Price: None; Value: *; Availability: Unavailable
D6 D14 D21 = Diode SHHT 506B: 600V/5A Diode SHHT 506B; MF: ON Semiconductor; MP: BZX84-C7V5; SnapEDA_Link: https://www.snapeda.com/parts/BZX84-C7V5/Onsemi/view-part/?ref=snap; Package: SOT-23 NXP Semiconductors; Value: *; Check_prices: https://www.snapeda.com/parts/BZX84-C7V5/Onsemi/view-part/?ref=eda
D7 D12 D13 D17 D18 = DIODE: Diode 1000V/1A SMB; Value: 1N4007
D8-D10 D19 = DIODE: Diode 600V/2A SMB thay the ES2J; Value: 1N4007
D11 = DIODE: Diode 1200V/5A; Value: 1N4007
D20 D23 D24 = Diode Zener Sot-95: BZX84-C18(Y6W) Zenner 18V thay the BZT52C18; MF: ON Semiconductor; MP: BZX84-C7V5; SnapEDA_Link: https://www.snapeda.com/parts/BZX84-C7V5/Onsemi/view-part/?ref=snap; Package: SOT-23 NXP Semiconductors; Value: *; Check_prices: https://www.snapeda.com/parts/BZX84-C7V5/Onsemi/view-part/?ref=eda
D22 = Dual-Diode_CA: LBAS40-06LT1G / S-LBAS40-06LT1G - thay thế BAW56; ki_keywords: Dual Diode Common Anode; Value: Dual_Diode_CA; Reference: D; ki_description: Dual Diode Common Anode
D25 = Dual-Diode_CA_1: BAT54S(D88) thay the BAV99:A7; ki_keywords: Dual Diode Common Anode; Value: Dual_Diode_CA; Reference: D; ki_description: Dual Diode Common Anode
H1 H4 H5 H7 = Jump2
H2 H3 H6 = Header 4P 2.54 Duc Thang: Cắm; Ten_Linh_Kien: Header 4P XH2.54-4P Đực Thẳng; Don_Vi: Con; Ma_Hang: MH001285; Chung_Loai: Cắm
H8 = Header 15x2: Header, 15x2-Pin 2.5mm; LatestRevisionDate: 17-Jul-2002; LatestRevisionNote: Re-released for DXP Platform.; Publisher: Altium Limited
K1 K2 K4 K5 = RELAY 10A/250V-SY: RELAY HF161F-W 277V/26A
K3 = HFD3--V/4.5: MF: Hongfa; MP: HFD3/012-L2; Package: None; Price: None; Value: *; SnapEDA_Link: https://www.snapeda.com/parts/HFD3/012-L2/Hon/view-part/?ref=snap; Availability: In Stock; Check_prices: https://www.snapeda.com/parts/HFD3/012-L2/Hon/view-part/?ref=eda
L1 L4 L6 L7 = L1: Inductor; Value: 150 mH
L2 = LAC2OG5K-V1: Cuon cam AC; Value: Loc 220; Designed by: VanDungEvn
L3 = LAC1OG5K-V1: Cuon cam AC; Value: Loc 220; Designed by: VanDungEvn
L8 = LPVOG5K-V1: Value: Loc 220; Designed by: VanDungEvn
LED1 = LED1-SMD: Value: LED 3 - 5 ly 2 Colour
M1-M5 P1-P6 P8-P12 = Copper
Q1 = B772M-PNP: thay the B772; Value: C9015
Q2 = D882M: thay the MMPT2222 40V/06A
Q3 Q5 = D882M
Q4 = MOSFET IRF N: 14N30; Value: IRF840
Q6 Q7 = D882M: NPN
R1-R142 R144-R146 = Res-SMD: Resistor; Manufacturer: Generic Components; Class: Passive; Published: 08/06/2000; Publisher: Altium Hobart Technology Centre
RV1-RV4 = Varistor B772: Varistor 420VAC 8000A(8/20us) B72220S0421K101; MP: B72220S0301K101; MF: TDK; Purchase-URL: https://pricing.snapeda.com/search/part/B72220S0301K101/?ref=eda; Package: None; SnapEDA_Link: https://www.snapeda.com/parts/B72220S0301K101/TDK/view-part/?ref=snap; Price: None; Availability: In Stock; Value: *; Check_prices: https://www.snapeda.com/parts/B72220S0301K101/TDK/view-part/?ref=eda
T1 = Tranf6: Off-Line Transformer WE-UNIT , L=0.9mH; PartNo: 749118205; Manufacturer: Würth Elektronik eiSos GmbH; Inductance: 0.9mH; Turns Ratio: 19:1:1; Input Voltage (AC): 85-265; Output Voltage (DC): 5; Output Current (A): 0.6; ComponentLink1Description: Manufacturer; ComponentLink1URL: http://www.we-online.de; Created by: Otto Christin; Created Date: OCT 2013; ComponentLink2Description: Datasheet; ComponentLink2URL: http://www.we-online.de/katalog/media/pdf/749118205.pdf
U1 U10 = Sensor STK-PL: Current Sensor sinomags STK-PL 50; Value: Loc 220; Designed by: VanDungEvn
U2 = ULN2003A: Power Switch/Driver 1:1 Darlington 500mA 16-SOP; MF: UMW; SnapEDA_Link: https://www.snapeda.com/parts/ULN2003A/Umwelt+Sensor+Teknik/view-part/?ref=snap; Package: None; Value: *; MP: ULN2003A; Check_prices: https://www.snapeda.com/parts/ULN2003A/Umwelt+Sensor+Teknik/view-part/?ref=eda
U3 = 78M05 SMD TO252: UTC 78D05AAL; Don_Vi: Con; Ten_Linh_Kien: 78M05 TO252; Ma_Hang: MH001917; Chung_Loai: Dán; Ghi_Chu: *; Kieu_Chan: *
U4 = LF347: Low Power Quad Operational Amplifier; Manufacturer Part Number: LF347BD; Manufacturer: Texas Instruments; Text Field1: pristel=Nsc\nsanopea\<parttype>.ckt; Slew Rate: 13 V/µs; Voltage - Supply, Single/Dual (±): 7 V ~ 36 V, ±3.5 V ~ 18 V; Current - Input Bias: 50pA; Voltage - Input Offset: 3000µV; Number of Circuits: 4; Gain Bandwidth Product: 3MHz; Amplifier Type: J-FET; Current - Supply: 8mA; Supplier 1: Digi-Key; Supplier Part Number 1: 296-7136-5-ND; Package / Case: 14-SOIC (3.9mm Width), 14-SOL; Supplier: Digi-Key; Current - Output / Channel: -; Packaging: Tube; RoHS: RoHS Compliant; Output Type: -; Operating Temperature: 0°C ~ 70°C; Category: Integrated Circuits (ICs); Supplier Part Number: 296-7136-5-ND
U5 = 7133_1: IC -12V; Note: Tab is connected to pin 3 (GND).; Published: 24-Aug-2001; LatestRevisionDate: 17-Jul-2002; LatestRevisionNote: Re-released for DXP Platform.; DatasheetVersion: Apr-1994; PackageReference: SOT82C; Publisher: Altium Limited; PackageDescription: SIP; 3 Leads; Body 10.9 x 7.6 x 2.6 mm (typ); Pitch 2.2 mm; ComponentLink1Description: Manufacturer Link; ComponentLink1URL: http://www.st.com/; ComponentLink2Description: Datasheet; ComponentLink2URL: http://www.st.com/stonline/products/literature/ds/2146/l78m05c.pdf
U6 = ICE3AR0680jz: HIGH PERFORMANCE CURRENT MODE PWM CONTROLLER; MP: UC2845BD1; Package: None; Price: None; Value: *; Availability: Unavailable
U7 = UC3843BVD1G: MF: ON Semiconductor; Package: SOIC-8 ON Semiconductor; Price: None; Check_prices: https://www.snapeda.com/parts/UC3843BVD1G/Onsemi/view-part/?ref=eda; Value: *; SnapEDA_Link: https://www.snapeda.com/parts/UC3843BVD1G/Onsemi/view-part/?ref=snap; MP: UC3843BVD1G; Availability: In Stock; Purchase-URL: https://pricing.snapeda.com/search?q=UC3843BVD1G&ref=eda
U8 = VOM617A-2T: OPTOISOLATOR 3.75KV TRANS 4-SOP; Solder: SMT; CompanyID: VT-xxxx; MPN: VOM617A-2T; Value: VOM617A-2T
U9 = TL431BIDR2G: TL431BIDR2G, Adjustable Shunt Voltage Reference 2.5 - 36V, 0.4%, 8-Pin SOIC | ON Semiconductor TL431BIDR2G; SnapEDA_Link: https://www.snapeda.com/parts/TL431BIDR2G/Onsemi/view-part/?ref=snap; Package: SOIC-8 ON Semiconductor; Value: *; MF: ON Semiconductor; MP: TL431BIDR2G; Check_prices: https://www.snapeda.com/parts/TL431BIDR2G/Onsemi/view-part/?ref=eda
VR1 = Varistor B772: Chống sét lan truyền B88069X4880S102(ví dụ); MP: B72220S0301K101; MF: TDK; Purchase-URL: https://pricing.snapeda.com/search/part/B72220S0301K101/?ref=eda; Package: None; SnapEDA_Link: https://www.snapeda.com/parts/B72220S0301K101/TDK/view-part/?ref=snap; Price: None; Availability: In Stock; Value: *; Check_prices: https://www.snapeda.com/parts/B72220S0301K101/TDK/view-part/?ref=eda